# Altium schematic sheet mos驱动.SchDoc
size A3
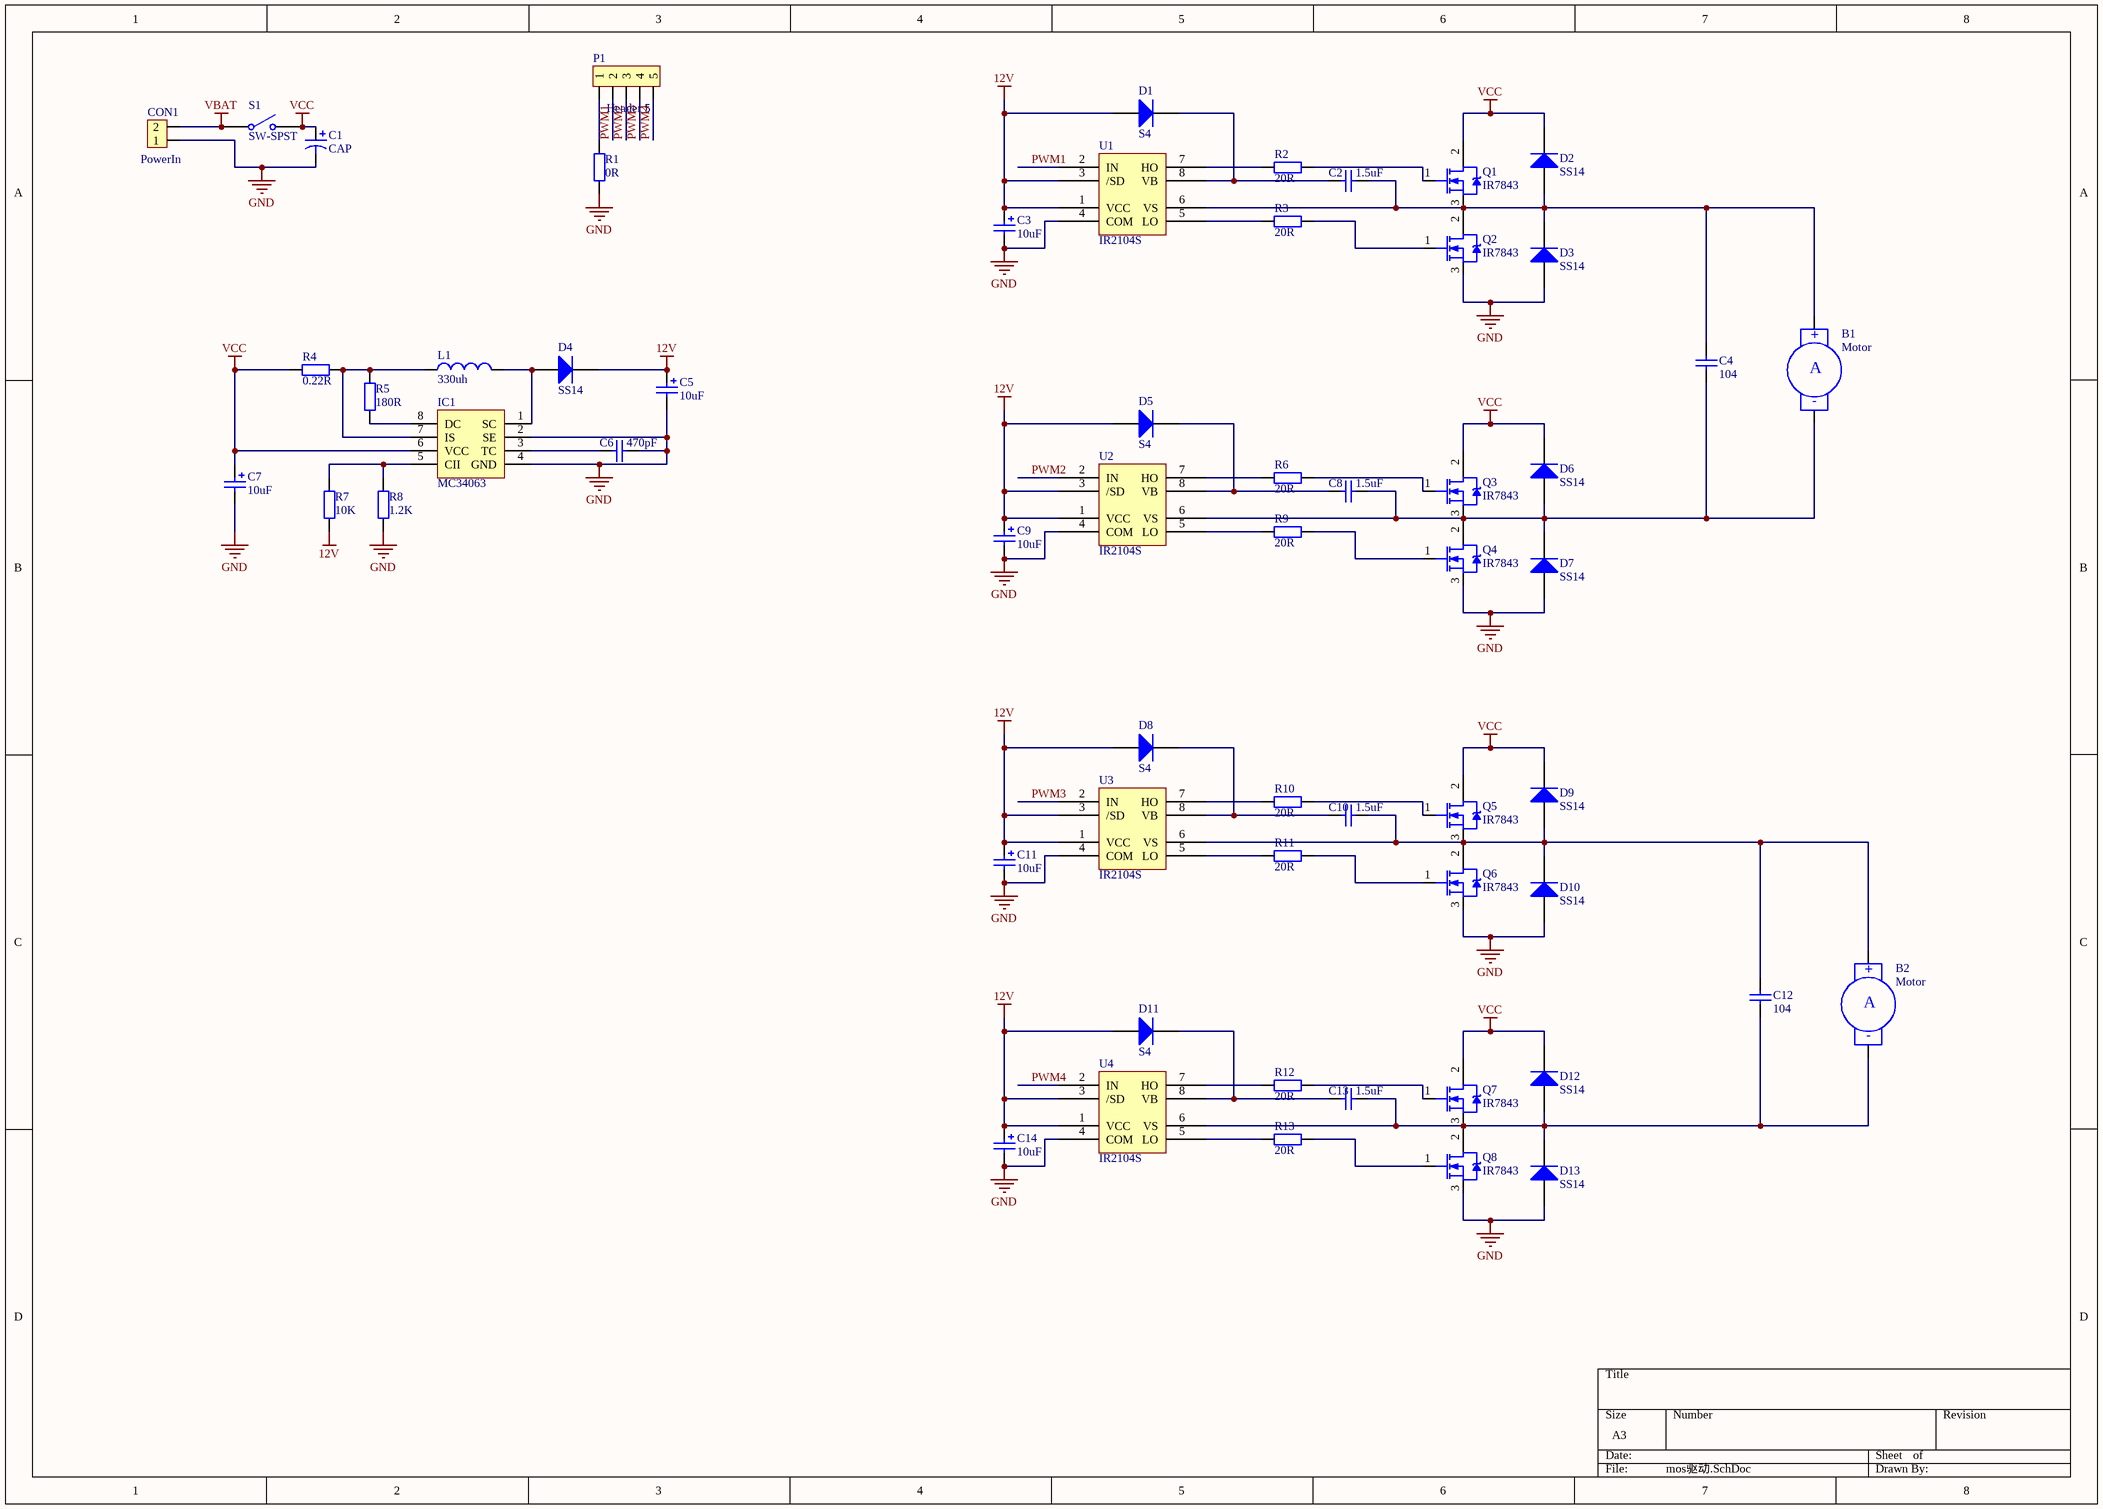
[diagram p0: mos驱动.SchDoc]

## Parts
B1  Motor  [KF301-2P]
B2  Motor  [KF301-2P]
C1  CAP  [SMD-EC-F12.5]
C2  value 1.5uF  [C2012]  (hidden comment: Cap)
C3  value 10uF  [C2012]  (hidden comment: Cap Pol1)
C4  value 104  [C2012]  (hidden comment: Cap)
C5  value 10uF  [1206C]  (hidden comment: Cap Pol1)
C6  value 470pF  [C2012]  (hidden comment: Cap)
C7  value 10uF  [1206C]  (hidden comment: Cap Pol1)
C8  value 1.5uF  [C2012]  (hidden comment: Cap)
C9  value 10uF  [C2012]  (hidden comment: Cap Pol1)
C10  value 1.5uF  [C2012]  (hidden comment: Cap)
C11  value 10uF  [C2012]  (hidden comment: Cap Pol1)
C12  value 104  [C2012]  (hidden comment: Cap)
C13  value 1.5uF  [C2012]  (hidden comment: Cap)
C14  value 10uF  [C2012]  (hidden comment: Cap Pol1)
CON1  PowerIn  [KF301-2P]
D1  S4  [R2012]
D2  SS14  [hole-chip diode]
D3  SS14  [hole-chip diode]
D4  SS14  [hole-chip diode]
D5  S4  [R2012]
D6  SS14  [hole-chip diode]
D7  SS14  [hole-chip diode]
D8  S4  [R2012]
D9  SS14  [hole-chip diode]
D10  SS14  [hole-chip diode]
D11  S4  [R2012]
D12  SS14  [hole-chip diode]
D13  SS14  [hole-chip diode]
IC1  MC34063  [SO-8]
L1  value 330uh  [SMD-EC-F8]  (hidden comment: Inductor)
P1  Header 5  [2.54XD_5]
Q1  IR7843  [LR7843]
Q2  IR7843  [LR7843]
Q3  IR7843  [LR7843]
Q4  IR7843  [LR7843]
Q5  IR7843  [LR7843]
Q6  IR7843  [LR7843]
Q7  IR7843  [LR7843]
Q8  IR7843  [LR7843]
R1  value 0R  [1206(2)]  (hidden comment: Res2)
R2  value 20R  [R2012]  (hidden comment: Res2)
R3  value 20R  [R2012]  (hidden comment: Res2)
R4  value 0.22R  [R2012]  (hidden comment: Res2)
R5  value 180R  [R2012]  (hidden comment: Res2)
R6  value 20R  [R2012]  (hidden comment: Res2)
R7  value 10K  [R2012]  (hidden comment: Res2)
R8  value 1.2K  [R2012]  (hidden comment: Res2)
R9  value 20R  [R2012]  (hidden comment: Res2)
R10  value 20R  [R2012]  (hidden comment: Res2)
R11  value 20R  [R2012]  (hidden comment: Res2)
R12  value 20R  [R2012]  (hidden comment: Res2)
R13  value 20R  [R2012]  (hidden comment: Res2)
S1  SW-SPST  [SW-125V6A(-)]
U1  IR2104S  [IR2104]
U2  IR2104S  [IR2104]
U3  IR2104S  [IR2104]
U4  IR2104S  [IR2104]

## Nets
12V: C3.1 C5.1 C9.1 C11.1 C14.1 D1.1(A) D4.2(K) D5.1(A) D8.1(A) D11.1(A) R7.1 U1.1(VCC) U1.3(/SD) U2.1(VCC) U2.3(/SD) U3.1(VCC) U3.3(/SD) U4.1(VCC) U4.3(/SD)
GND: C1.2 C3.2 C5.2 C6.1 C7.2 C9.2 C11.2 C14.2 CON1.1 D3.1(A) D7.1(A) D10.1(A) D13.1(A) IC1.2(SE) IC1.4(GND) Q2.3(S) Q4.3(S) Q6.3(S) Q8.3(S) R1.1 R8.1 U1.4(COM) U2.4(COM) U3.4(COM) U4.4(COM)
VBAT: CON1.2 S1.1(COMMON)
VCC: C1.1 C7.1 D2.2(K) D6.2(K) D9.2(K) D12.2(K) IC1.6(VCC) Q1.2(D) Q3.2(D) Q5.2(D) Q7.2(D) R4.1 S1.2(NO)
PWM1: P1.2 U1.2(IN)
PWM2: P1.3 U2.2(IN)
PWM3: P1.4 U3.2(IN)
PWM4: P1.5 U4.2(IN)
NetB1_1: B1.1(+) C2.1 C4.1 D2.1(A) D3.2(K) Q1.3(S) Q2.2(D) U1.6(VS)
NetB1_2: B1.2(-) C4.2 C8.1 D6.1(A) D7.2(K) Q3.3(S) Q4.2(D) U2.6(VS)
NetB2_1: B2.1(+) C10.1 C12.1 D9.1(A) D10.2(K) Q5.3(S) Q6.2(D) U3.6(VS)
NetB2_2: B2.2(-) C12.2 C13.1 D12.1(A) D13.2(K) Q7.3(S) Q8.2(D) U4.6(VS)
NetC2_2: C2.2 D1.2(K) U1.8(VB)
NetC6_2: C6.2 IC1.3(TC)
NetC8_2: C8.2 D5.2(K) U2.8(VB)
NetC10_2: C10.2 D8.2(K) U3.8(VB)
NetC13_2: C13.2 D11.2(K) U4.8(VB)
NetD4_1: D4.1(A) IC1.1(SC) L1.2
NetIC1_5: IC1.5(CII) R7.2 R8.2
NetIC1_7: IC1.7(IS) L1.1 R4.2 R5.2
NetIC1_8: IC1.8(DC) R5.1
NetP1_1: P1.1 R1.2
NetQ1_1: Q1.1(G) R2.2
NetQ2_1: Q2.1(G) R3.2
NetQ3_1: Q3.1(G) R6.2
NetQ4_1: Q4.1(G) R9.2
NetQ5_1: Q5.1(G) R10.2
NetQ6_1: Q6.1(G) R11.2
NetQ7_1: Q7.1(G) R12.2
NetQ8_1: Q8.1(G) R13.2
NetR2_1: R2.1 U1.7(HO)
NetR3_1: R3.1 U1.5(LO)
NetR6_1: R6.1 U2.7(HO)
NetR9_1: R9.1 U2.5(LO)
NetR10_1: R10.1 U3.7(HO)
NetR11_1: R11.1 U3.5(LO)
NetR12_1: R12.1 U4.7(HO)
NetR13_1: R13.1 U4.5(LO)

## Notes on the sheet
- (in symbol Motor Servo) A

## Library data of the parts
B1 B2 = Motor Servo: Servo Motor
C1 = CAP+
C2 C4 C6 C8 C10 C12 C13 = Cap: Capacitor; Published: 8-Jun-2000; LatestRevisionDate: 17-Jul-2002; LatestRevisionNote: Re-released for DXP Platform.; PackageReference: RAD-0.3; Publisher: Altium Limited; PackageDescription: Radial Cap, Thru-Hole; 2 Leads; 0.3 in Pin Spacing
C3 C5 C7 C9 C11 C14 = Cap Pol1: Polarized Capacitor (Radial); Published: 8-Jun-2000; LatestRevisionDate: 17-Jul-2002; LatestRevisionNote: Re-released for DXP Platform.; PackageReference: RB7.6-15; Publisher: Altium Limited; PackageDescription: Polarized Capacitor (Radial); 2 Leads
CON1 = Header 2: Header, 2-Pin
D1-D13 = Diode 1N4007: 1 Amp General Purpose Rectifier; Published: 8-Jun-2000; LatestRevisionDate: 17-Jul-2002; LatestRevisionNote: Re-released for DXP Platform.; DatasheetVersion: 1998; PackageVersion: Aug-1999; PackageReference: DO-41; Publisher: Altium Limited; Code_JEDEC: DO-204-AL; ComponentLink1Description: Manufacturer Link; ComponentLink1URL: http://www.fairchildsemi.com/; ComponentLink2Description: Datasheet; ComponentLink2URL: http://www.fairchildsemi.com/ds/1N%2F1N4001.pdf
L1 = Inductor: Code_IEC: 1005; Published: 8-Jun-2000; LatestRevisionDate: 29-May-2009; LatestRevisionNote: IPC-7351 Footprint Added.; PackageReference: 0402-A; Publisher: Altium Limited; PackageDescription: Chip Inductor; Code_JEITA: 0402
P1 = Header 5: Header, 5-Pin
Q1-Q8 = NMOS-2: N-Channel Power MOSFET; Note: Pin 2 is electrically connected to pin 4.; Published: 8-Jun-2000; LatestRevisionDate: 17-Jul-2002; LatestRevisionNote: Re-released for DXP Platform.; DatasheetVersion: PD-9.814; PackageVersion: Feb-1997; PackageReference: TO-220AB; Publisher: Altium Limited; PackageDescription: TO, Thru-Hole, Vertical, Heatsink Mounted; 3 In-Line Leads; Pitch 2.54 mm; ComponentLink1Description: Manufacturer Link; ComponentLink1URL: http://www.irf.com/
R1-R13 = Res2: Resistor; Published: 8-Jun-2000; LatestRevisionDate: 17-Jul-2002; LatestRevisionNote: Re-released for DXP Platform.; PackageReference: AXIAL-0.4; Publisher: Altium Limited; PackageDescription: Axial Device, Thru-Hole; 2 Leads; 0.4 in Pin Spacing
S1 = SW-SPST: Single-Pole, Single-Throw Switch; Published: 24-Mar-1999; LatestRevisionDate: 17-Jul-2002; LatestRevisionNote: Re-released for DXP Platform.; PackageReference: SPST-2; Publisher: Altium Limited
U1-U4 = Component_1_1